# EAGLE design KeypadDisplay RPi rev A (EAGLE 9.4.2)
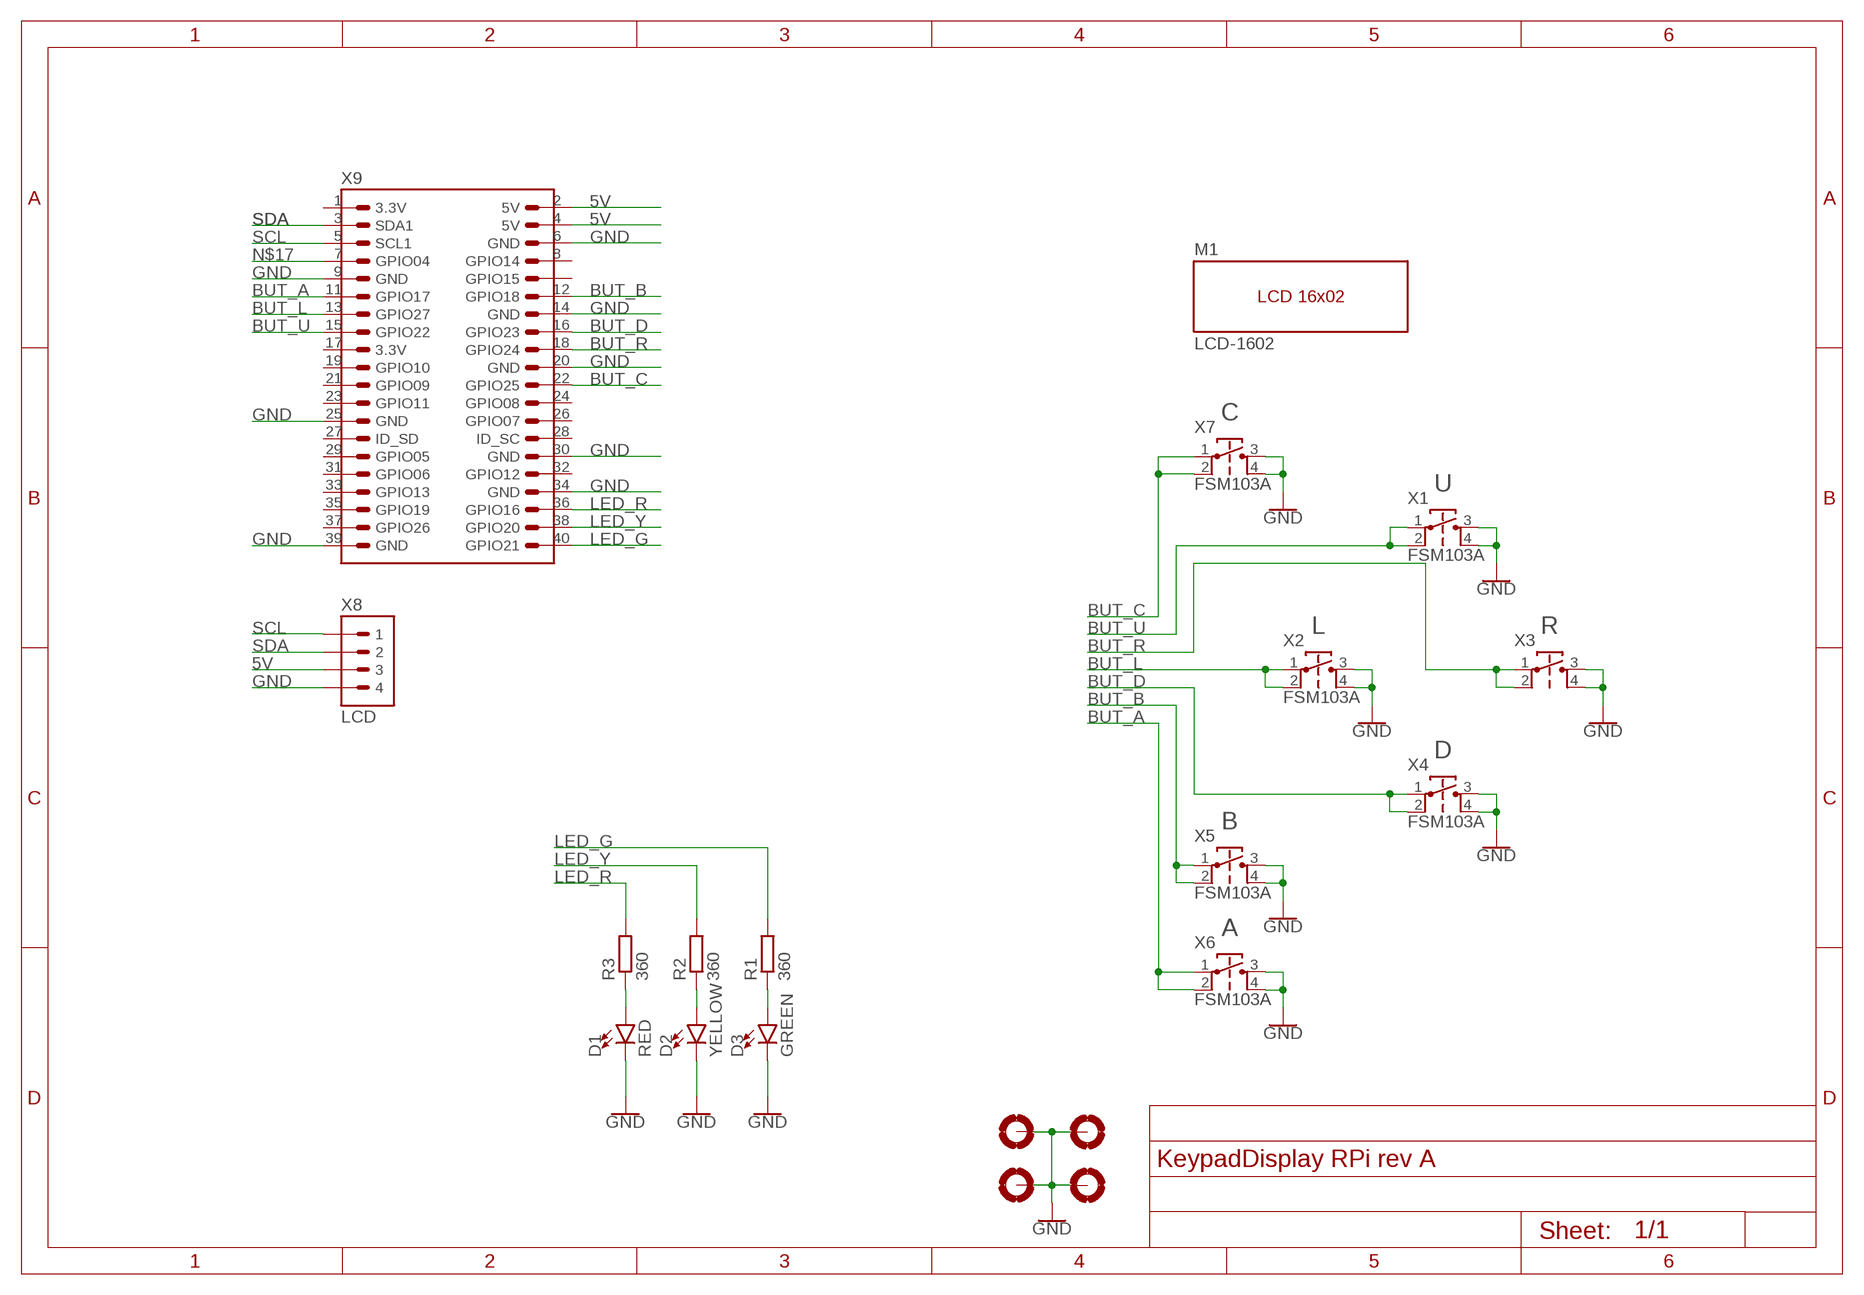
[diagram p0: schematic, sheet 1]

## Parts
D1  RED  LED5MM  [LED5MM]
D2  YELLOW  LED5MM  [LED5MM]
D3  GREEN  LED5MM  [LED5MM]
H1  MOUNTHOLE-PAD3.0  [3.0-PAD]
H2  MOUNTHOLE-PAD3.0  [3.0-PAD]
H3  MOUNTHOLE-PAD3.0  [3.0-PAD]
H4  MOUNTHOLE-PAD3.0  [3.0-PAD]
M1  LCD-1602  LCD-1602-NOHEADER  [LCD-1602-NOHEADER]
R1  360  R-EU_0204/7  [0204/7]
R2  360  R-EU_0204/7  [0204/7]
R3  360  R-EU_0204/7  [0204/7]
X1  FSM103A  TACT-SWITCHFSM103A  [TACT-SWITCH-FSM103A]
X2  FSM103A  TACT-SWITCHFSM103A  [TACT-SWITCH-FSM103A]
X3  TACT-SWITCHFSM103A  [TACT-SWITCH-FSM103A]
X4  FSM103A  TACT-SWITCHFSM103A  [TACT-SWITCH-FSM103A]
X5  FSM103A  TACT-SWITCHFSM103A  [TACT-SWITCH-FSM103A]
X6  FSM103A  TACT-SWITCHFSM103A  [TACT-SWITCH-FSM103A]
X7  FSM103A  TACT-SWITCHFSM103A  [TACT-SWITCH-FSM103A]
X8  LCD  HEADER-1X04-2.54POL  [1X04P-2.54]
X9  HEADER-RPI-2X20  [2X20-2.54]

## Nets
5V: X8.3 X9.2(5V) X9.4(5V)
BUT_A: X6.1(A) X6.2(A') X9.11(GPIO17)
BUT_B: X5.1(A) X5.2(A') X9.12(GPIO18)
BUT_C: X7.1(A) X7.2(A') X9.22(GPIO25)
BUT_D: X4.1(A) X4.2(A') X9.16(GPIO23)
BUT_L: X2.1(A) X2.2(A') X9.13(GPIO27)
BUT_R: X3.1(A) X3.2(A') X9.18(GPIO24)
BUT_U: X1.1(A) X1.2(A') X9.15(GPIO22)
GND: D1.K(C) D2.K(C) D3.K(C) H1.B3,2(MOUNT) H2.B3,2(MOUNT) H3.B3,2(MOUNT) H4.B3,2(MOUNT) X1.3(B) X1.4(B') X2.3(B) X2.4(B') X3.3(B) X3.4(B') X4.3(B) X4.4(B') X5.3(B) X5.4(B') X6.3(B) X6.4(B') X7.3(B) X7.4(B') X8.4 X9.6(GND) X9.9(GND) X9.14(GND) X9.20(GND) X9.25(GND) X9.30(GND) X9.34(GND) X9.39(GND)
LED_G: R1.2 X9.40(GPIO21)
LED_R: R3.2 X9.36(GPIO16)
LED_Y: R2.2 X9.38(GPIO20)
N$12: D1.A R3.1
N$13: D2.A R2.1
N$14: D3.A R1.1
N$17: X9.7(GPIO04)
SCL: X8.1 X9.5(SCL1)
SDA: X8.2 X9.3(SDA1)
Unconnected: X9.8(GPIO14) X9.10(GPIO15) X9.19(GPIO10) X9.21(GPIO09) X9.23(GPIO11) X9.24(GPIO08) X9.26(GPIO07) X9.27(ID_SD) X9.28(ID_SC) X9.29(GPIO05) X9.31(GPIO06) X9.32(GPIO12) X9.33(GPIO13) X9.35(GPIO19) X9.37(GPIO26)

## Notes on the sheet
- C
- U
- L | R
- D
- B
- A

## Power pins joined to a net without a drawn wire
3.3V: X9.1(3.3V) X9.17(3.3V)

## Library data of the parts
D1-D3 = M2M-LED:LED: LED (Generic) Standard schematic elements and footprints for 5mm, 3mm, 1206, and 0603 sized LEDs. Generic LEDs with no color specified.
H1-H4 = M2M-Holes:MOUNTHOLE-PAD
M1 = M2M-Modules:LCD-1602-NOHEADER
R1-R3 = rcl:R-EU_: RESISTOR, European symbol; SPICEPREFIX: R
X1-X7 = M2M-Switches:TACT-SWITCH
X8 = M2M-Connectors:HEADER-1X04-2.54
X9 = M2M-Connectors:HEADER-RPI-2X20

## Board
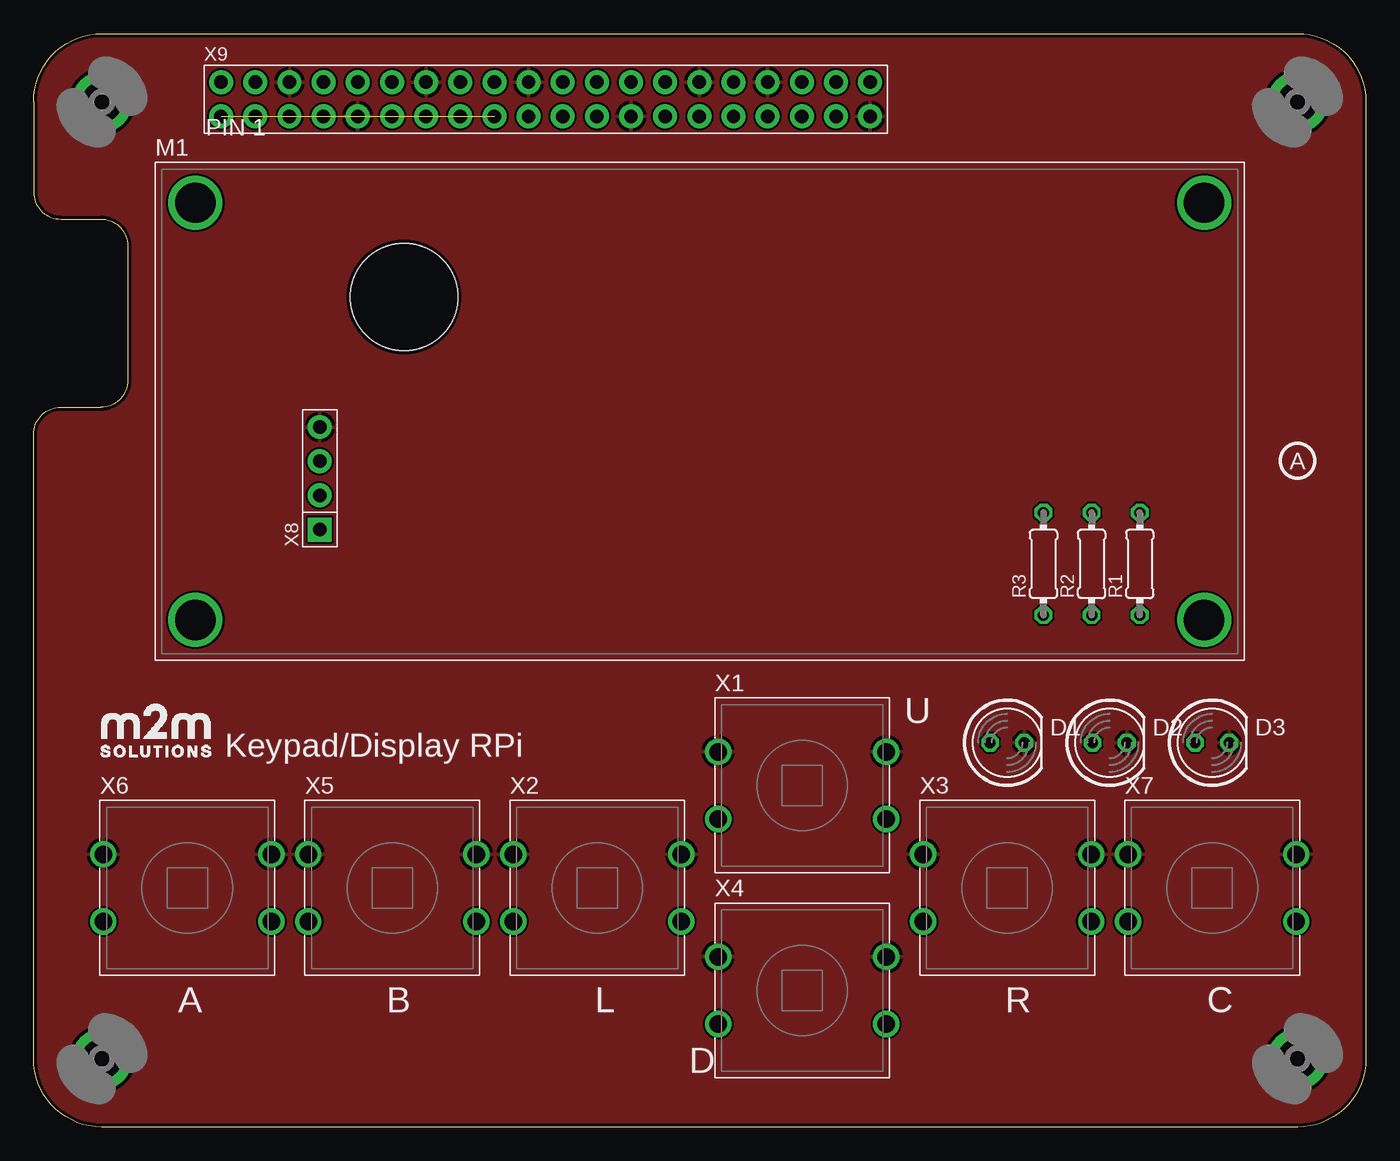
[diagram p1: board, top side]
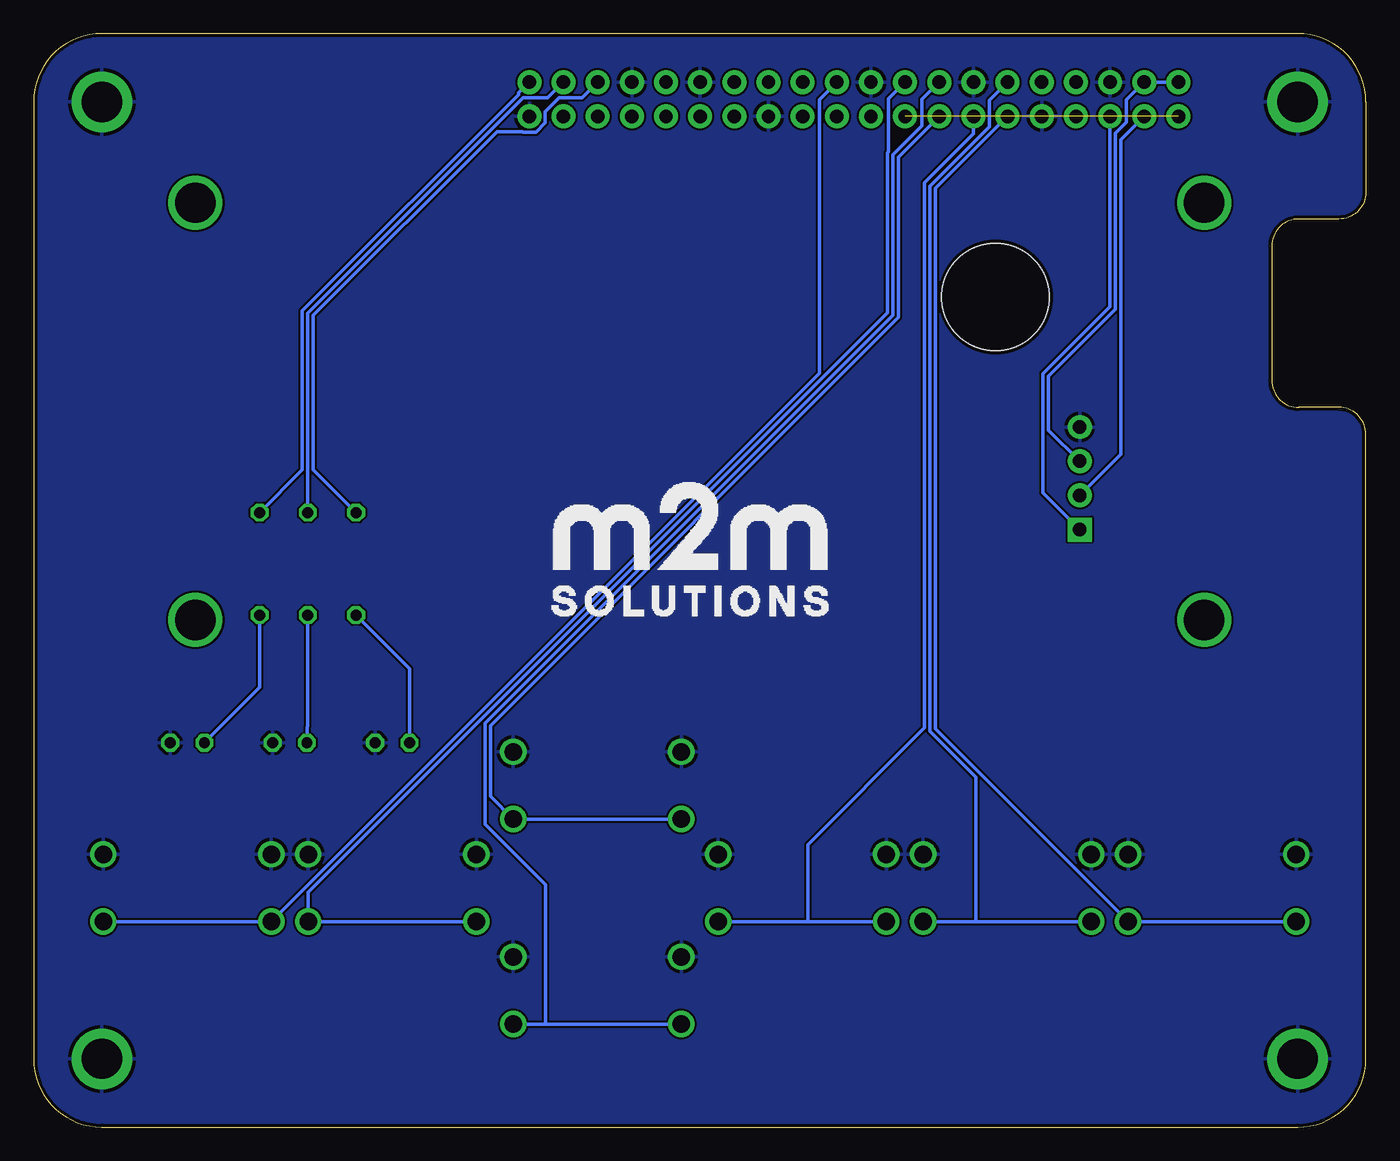
[diagram p2: board, bottom side, seen from below]

Size 99.06 x 81.28 mm. Coordinates in mm from the lower left corner, seen from the top.
Outline: 0,5.08 arc90 5.08,0 93.98,0 arc90 99.06,5.08 99.06,76.2 arc90 93.98,81.28 5.08,81.28 arc90 0,76.2 0,69.5 arc90 2,67.5 5,67.5 arc-90 7,65.5 7,55.5 arc-90 5,53.5 2,53.5 arc90 0,51.5 0,5
Copper layers (1*16): Top 0.035mm / dielectric 1.5mm / Bottom 0.035mm
Design rules "SeeedStudio_2layer_DRU_no_angle_20140221": minimum track width 6mil, minimum drill 12mil, track to track 6mil, track to pad 6mil, pad to pad 6mil, via to via 6mil, smd to smd 0mil, copper to edge 10mil, drill to drill 10mil, minimum pad ring 10mil, minimum via ring 6mil, stop-mask expansion 2mil, vias tented up to drill 100mil, thermal gap 10mil

### Footprints (pad centres in the part's own frame; a part is rotated, then mirrored left to right if it is on the bottom)
LED5MM = drill 0.813 octagon: A -1.27,0; K 1.27,0
3.0-PAD = drill 3 pad 4.5: B3,2 0,0
LCD-1602-NOHEADER = drill 3: P$1 -37.5,15.5; P$2 37.5,15.5; P$3 37.5,-15.5; P$4 -37.5,-15.5 | hole 8: -22,8.5
0204/7 = drill 0.813 octagon: 1 -3.81,0; 2 3.81,0
TACT-SWITCH-FSM103A = drill 1.3: 1 6.25,-2.5; 2 -6.25,-2.5; 3 6.25,2.5; 4 -6.25,2.5
1X04P-2.54 = drill 1 pad 1.778 square: 1 0,0 | drill 1 pad 1.778: 2 2.54,0; 3 5.08,0; 4 7.62,0
2X20-2.54 = drill 1 pad 1.778: 1 0,0; 2 0,2.54; 3 2.54,0; 4 2.54,2.54; 5 5.08,0; 6 5.08,2.54; 7 7.62,0; 8 7.62,2.54; 9 10.16,0; 10 10.16,2.54; 11 12.7,0; 12 12.7,2.54; 13 15.24,0; 14 15.24,2.54; 15 17.78,0; 16 17.78,2.54; 17 20.32,0; 18 20.32,2.54; 19 22.86,0; 20 22.86,2.54; 21 25.4,0; 22 25.4,2.54; 23 27.94,0; 24 27.94,2.54; 25 30.48,0; 26 30.48,2.54; 27 33.02,0; 28 33.02,2.54; 29 35.56,0; 30 35.56,2.54; 31 38.1,0; 32 38.1,2.54; 33 40.64,0; 34 40.64,2.54; 35 43.18,0; 36 43.18,2.54; 37 45.72,0; 38 45.72,2.54; 39 48.26,0; 40 48.26,2.54

### Placement (x,y rotation side)
D1  72.39,28.57 0 top
D2  80.01,28.57 0 top
D3  87.63,28.57 0 top
H1  5.08,5.08 0 top
H2  93.98,5.08 0 top
H3  5.08,76.2 0 top
H4  93.98,76.2 0 top
M1  49.53,53.2 0 top
R1  82.25,41.87 90 top
R2  78.67,41.87 90 top
R3  75.09,41.87 90 top
U$1  [M2M-10MMB]  40,38 0 top
U$2  [M2M-LOGO-4MM]  5,27.5 0 top
X1  57.15,25.4 0 top
X2  41.91,17.78 0 top
X3  72.39,17.78 0 top
X4  57.15,10.16 0 top
X5  26.67,17.78 0 top
X6  11.43,17.78 0 top
X7  87.63,17.78 0 top
X8  21.28,44.42 90 top
X9  13.94,75.13 0 top

### Tracks (layer width: path | path; a pad name or v marks a point on that pad's centre or on a via)
3.3V  (1 unrouted)
5V
  Bottom 0.254: X8.3 23.59,51.81 23.59,55.83 18.61,60.81 18.61,73.89 18.54,73.96 17.8,74.7 17.8,76.35 X9.4 X9.2
BUT_A
  Bottom 0.254: X6.2 X6.1 32,29.6 32,69.77 X9.11
BUT_B
  Bottom 0.254: X5.2 29,15.28 | 29,15.28 X5.1 | 29,15.28 29,26.02 32.41,29.43 32.41,69.94 28,74.34 28,76.31 X9.12
BUT_C
  Bottom 0.254: X7.2 X7.1 | X7.2 | X7.2 40.64,56.02 40.64,76.37 X9.22
BUT_D
  Bottom 0.254: X4.2 61,7.66 | 61,7.66 X4.1 | 61,7.66 61,18 65.5,22.5 65.5,30.01 35.15,60.36 35.15,72.27 33,74.42 33,76.39 X9.16
BUT_L
  Bottom 0.254: X2.2 41.5,15.28 | 41.5,15.28 X2.1 | 41.5,15.28 41.5,21 33,29.5 32.81,29.69 32.81,70.19 29.18,73.82 X9.13
BUT_R
  Bottom 0.254: X3.2 X3.1 78.64,17.45 35.56,60.52 35.56,72.44 35.5,72.5 35.5,76.43 X9.18
BUT_U
  Bottom 0.254: X1.2 X1.1 65.09,24.59 65.09,29.84 34.75,60.19 34.75,72.1 X9.15
GND
  pour Top: 0,0 0,82.55 101.6,82.55 101.6,0
  pour Bottom: 0,0 0,81.28 99.06,81.28 99.06,0
LED_G
  Bottom 0.254: X9.40 63,76.87 63,76.75 79.08,60.67 79.08,48.85 R1.2
LED_R
  Bottom 0.254: X9.36 58.29,76.5 60,76.5 61.03,75.47 61.03,74.65 61.72,73.96 62.68,73.96 62.72,74 64.59,74 78.26,60.33 78.26,48.85 R3.2
LED_Y
  Bottom 0.254: R2.2 78.67,60.5 62.67,76.5 60.83,76.5 X9.38
N$12
  Bottom 0.254: D1.A 71.12,34.09 R3.1
N$13
  Bottom 0.254: D2.A 78.74,29.73 78.67,29.8 R2.1
N$14
  Bottom 0.254: D3.A 82.25,32.69 R1.1
SCL
  Bottom 0.254: X8.1 24,47.14 24,56 23.75,56.25 19.02,60.98 X9.5
SDA
  Bottom 0.254: X9.3 18.21,73.4 18.21,50.03 X8.2

### Text on the board
tPlace: PIN 1 | A | U | Keypad/Display RPi | A | B | L | R | C | D